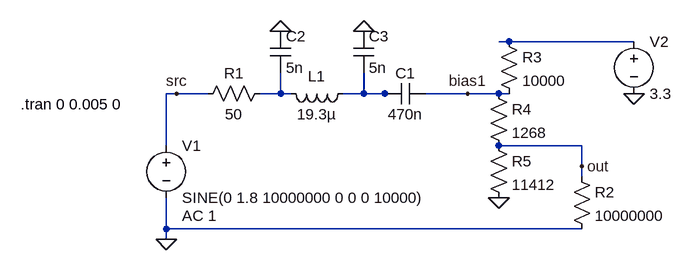
[diagram p0: schematic sim.asc]
sim.asc, the LTspice schematic file:
Version 4.1
SHEET 1 1088 680
WIRE 832 -16 816 -16
WIRE 1024 -16 832 -16
WIRE 320 64 304 64
WIRE 368 64 320 64
WIRE 480 64 480 32
WIRE 480 64 448 64
WIRE 496 64 480 64
WIRE 608 64 608 32
WIRE 608 64 576 64
WIRE 640 64 608 64
WIRE 656 64 640 64
WIRE 768 64 704 64
WIRE 816 64 768 64
WIRE 832 64 816 64
WIRE 304 144 304 64
WIRE 944 144 816 144
WIRE 944 176 944 144
WIRE 944 192 944 176
WIRE 304 272 304 224
WIRE 944 272 304 272
WIRE 304 288 304 272
FLAG 304 288 0
FLAG 320 64 src
FLAG 944 176 out
FLAG 816 224 0
FLAG 1024 64 0
FLAG 480 -32 0
FLAG 608 -32 0
FLAG 768 64 bias1
SYMBOL voltage 304 128 R0
WINDOW 123 24 124 Left 2
WINDOW 39 0 0 Left 0
SYMATTR InstName V1
SYMATTR Value SINE(0 1.8 10000000 0 0 0 10000)
SYMATTR Value2 AC 1
SYMBOL res 464 48 R90
WINDOW 0 0 56 VBottom 2
WINDOW 3 32 56 VTop 2
SYMATTR InstName R1
SYMATTR Value 50
SYMBOL res 928 176 R0
SYMATTR InstName R2
SYMATTR Value 10000000
SYMBOL res 816 -32 R0
SYMATTR InstName R3
SYMATTR Value 10000
SYMBOL res 800 48 R0
SYMATTR InstName R4
SYMATTR Value 1268
SYMBOL voltage 1024 -32 R0
WINDOW 123 0 0 Left 0
WINDOW 39 0 0 Left 0
SYMATTR InstName V2
SYMATTR Value 3.3
SYMBOL cap 704 48 R90
WINDOW 0 0 32 VBottom 2
WINDOW 3 32 32 VTop 2
SYMATTR InstName C1
SYMATTR Value 470n
SYMBOL ind 592 48 R90
WINDOW 0 5 56 VBottom 2
WINDOW 3 32 56 VTop 2
SYMATTR InstName L1
SYMATTR Value 19.3µ
SYMBOL cap 464 -32 R0
SYMATTR InstName C2
SYMATTR Value 5n
SYMBOL cap 592 -32 R0
SYMATTR InstName C3
SYMATTR Value 5n
SYMBOL res 800 128 R0
SYMATTR InstName R5
SYMATTR Value 11412
TEXT 80 80 Left 2 !.tran 0 0.005 0

The netlist it stands for:
* sim.asc
V1 src 0 SINE(0 1.8 10000000 0 0 0 10000) AC 1
R1 N002 src 50
R2 out 0 10000000
R3 N001 bias1 10000
R4 bias1 out 1268
V2 N001 0 3.3
C1 bias1 N003 470n
L1 N003 N002 19.3µ
C2 0 N002 5n
C3 0 N003 5n
R5 out 0 11412
.tran 0 0.005 0
.backanno
.end